# Altium project PCB_Project1.PrjPCB
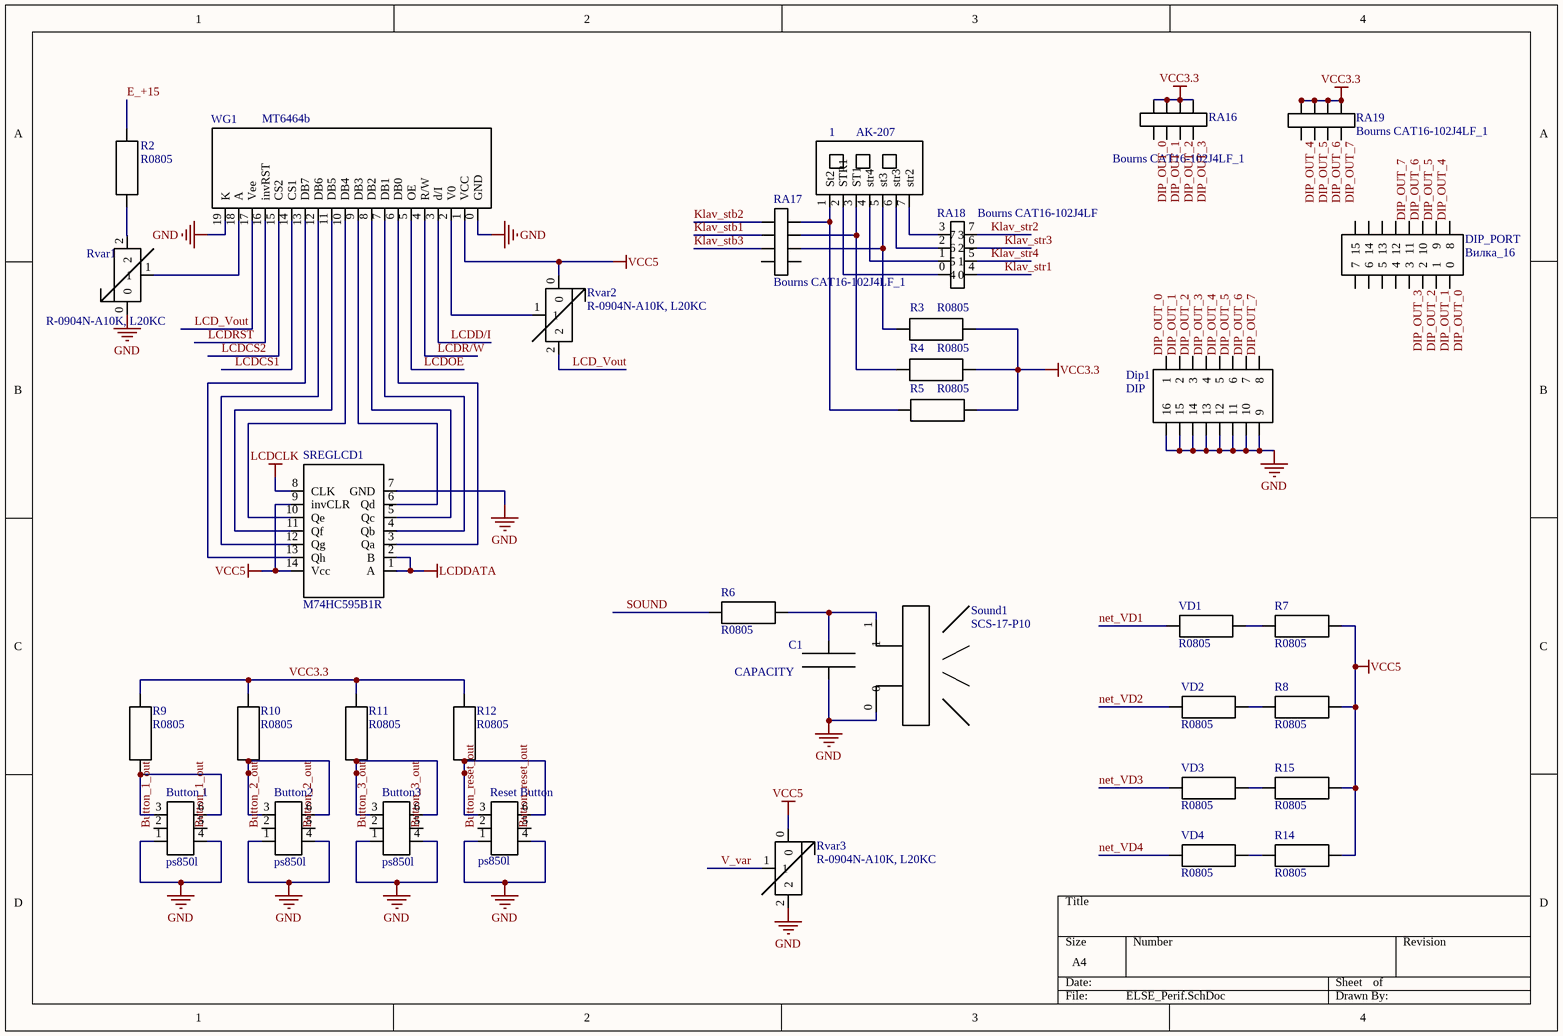
[diagram p0: ELSE_Perif.SchDoc]
6 sheets, 97 parts. Net scope: global (net labels, ports and power ports of the same name join across sheets).
Board file: ElvipPCB.PcbDoc
Sheets:
  ELSE_Perif.SchDoc
  Power Supplies.SchDoc
  Ports_2.SchDoc
  ELVIS.SchDoc
  7SEG-2.SchDoc
  MainConnector.SchDoc

## Sheet ELSE_Perif.SchDoc
size A4

### Parts
1  AK-207  [AK-207]
Button2  ps850l  [ps850l]
Button3  ps850l  [ps850l]
Button_1  ps850l  [ps850l]
C1  CAPACITY  [R0805]
Dip1  DIP  [SWD1-8]
DIP_PORT  Вилка_16  [DS1013-16]
R2  R0805  [R0805]
R3  R0805  [R0805]
R4  R0805  [R0805]
R5  R0805  [R0805]
R6  R0805  [R0805]
R7  R0805  [R0805]
R8  R0805  [R0805]
R9  R0805  [R0805]
R10  R0805  [R0805]
R11  R0805  [R0805]
R12  R0805  [R0805]
R14  R0805  [R0805]
R15  R0805  [R0805]
RA16  Bourns CAT16-102J4LF_1  [CAT16-102J4LF_2]
RA17  Bourns CAT16-102J4LF_1  [CAT16-102J4LF_2]
RA18  Bourns CAT16-102J4LF  [CAT16-102J4LF]
RA19  Bourns CAT16-102J4LF_1  [CAT16-102J4LF_2]
Reset_Button  ps850l  [ps850l]
Rvar1  R-0904N-A10K, L20KC  [R-0904N-A10K, L20KC]
Rvar2  R-0904N-A10K, L20KC  [R-0904N-A10K, L20KC]
Rvar3  R-0904N-A10K, L20KC  [R-0904N-A10K, L20KC]
Sound1  SCS-17-P10  [SCS-17-P10]
SREGLCD1  M74HC595B1R  [SN74HC164DRX]
VD1  R0805  [R0805]
VD2  R0805  [R0805]
VD3  R0805  [R0805]
VD4  R0805  [R0805]
WG1  MT6464b  [WG12864A]

### Nets
GND: Button2.1 Button2.4 Button3.1 Button3.4 Button_1.1 Button_1.4 C1.1 Dip1.9 Dip1.10 Dip1.11 Dip1.12 Dip1.13 Dip1.14 Dip1.15 Dip1.16 Reset_Button.1 Reset_Button.4 Rvar1.0 Rvar3.2 Sound1.0 SREGLCD1.7(GND) WG1.0(GND) WG1.19(K)
lCDCLK: SREGLCD1.8(CLK)
lCDDATA: SREGLCD1.1(A) SREGLCD1.2(B)
VCC3.3: R3.1 R4.1 R5.1 R9.1 R10.1 R11.1 R12.1 RA16.4 RA16.5 RA16.6 RA16.7 RA19.4 RA19.5 RA19.6 RA19.7
VCC5: R7.2 R8.2 R14.2 R15.2 Rvar2.0 Rvar3.0 SREGLCD1.9(invCLR) SREGLCD1.14(Vcc) WG1.1(VCC)
Button_1_out: Button_1.2 Button_1.5
Button_2_out: Button2.2 Button2.5
Button_3_out: Button3.2 Button3.5
Button_reset_out: Reset_Button.2 Reset_Button.5
DIP_OUT_0: Dip1.1 DIP_PORT.0 RA16.0
DIP_OUT_1: Dip1.2 DIP_PORT.1 RA16.1
DIP_OUT_2: Dip1.3 DIP_PORT.2 RA16.2
DIP_OUT_3: Dip1.4 DIP_PORT.3 RA16.3
DIP_OUT_4: Dip1.5 DIP_PORT.8 RA19.0
DIP_OUT_5: Dip1.6 DIP_PORT.9 RA19.1
DIP_OUT_6: Dip1.7 DIP_PORT.10 RA19.2
DIP_OUT_7: Dip1.8 DIP_PORT.11 RA19.3
E_+15: R2.2
Klav_stb1: RA17.2
Klav_stb2: RA17.3
Klav_stb3: RA17.1
Klav_str1: RA18.4
Klav_str2: RA18.7
Klav_str3: RA18.6
Klav_str4: RA18.5
LCD_Vout: Rvar2.2 WG1.17(Vee)
LCDCS1: WG1.14(CS1)
LCDCS2: WG1.15(CS2)
LCDD/I: WG1.3(d/I)
LCDOE: WG1.5(OE)
LCDR/W: WG1.4(R/W)
LCDRST: WG1.16(invRST)
net_VD1: VD1.1
net_VD2: VD2.1
net_VD3: VD3.1
net_VD4: VD4.1
SOUND: R6.1
V_var: Rvar3.1
Net1_1: 1.1(St2) R5.2 RA17.4
Net1_2: 1.2(STR1) RA18.0
Net1_3: 1.3(ST1) R4.2 RA17.5
Net1_4: 1.4(str4) RA18.1
Net1_5: 1.5(st3) R3.2 RA17.6
Net1_6: 1.6(str3) RA18.2
Net1_7: 1.7(str2) RA18.3
NetButton2_3: Button2.3 Button2.6 R10.2
NetButton3_3: Button3.3 Button3.6 R11.2
NetButton_1_3: Button_1.3 Button_1.6 R9.2
NetC1_2: C1.2 R6.2 Sound1.1
NetR2_1: R2.1 Rvar1.2
NetR7_1: R7.1 VD1.2
NetR8_1: R8.1 VD2.2
NetR12_2: R12.2 Reset_Button.3 Reset_Button.6
NetR14_1: R14.1 VD4.2
NetR15_1: R15.1 VD3.2
NetRvar1_1: Rvar1.1 WG1.18(A)
NetRvar2_1: Rvar2.1 WG1.2(V0)
NetSREGLCD1_3: SREGLCD1.3(Qa) WG1.6(DB0)
NetSREGLCD1_4: SREGLCD1.4(Qb) WG1.7(DB1)
NetSREGLCD1_5: SREGLCD1.5(Qc) WG1.8(DB2)
NetSREGLCD1_6: SREGLCD1.6(Qd) WG1.9(DB3)
NetSREGLCD1_10: SREGLCD1.10(Qe) WG1.10(DB4)
NetSREGLCD1_11: SREGLCD1.11(Qf) WG1.11(DB5)
NetSREGLCD1_12: SREGLCD1.12(Qg) WG1.12(DB6)
NetSREGLCD1_13: SREGLCD1.13(Qh) WG1.13(DB7)

Not connected (* = marked no-connect by the designer): DIP_PORT 4 5 6 7 12 13 14 15; RA17 0 7

### Library data of the parts
DIP_PORT = DS1013-16: 16_pin

## Sheet Power Supplies.SchDoc
size A4
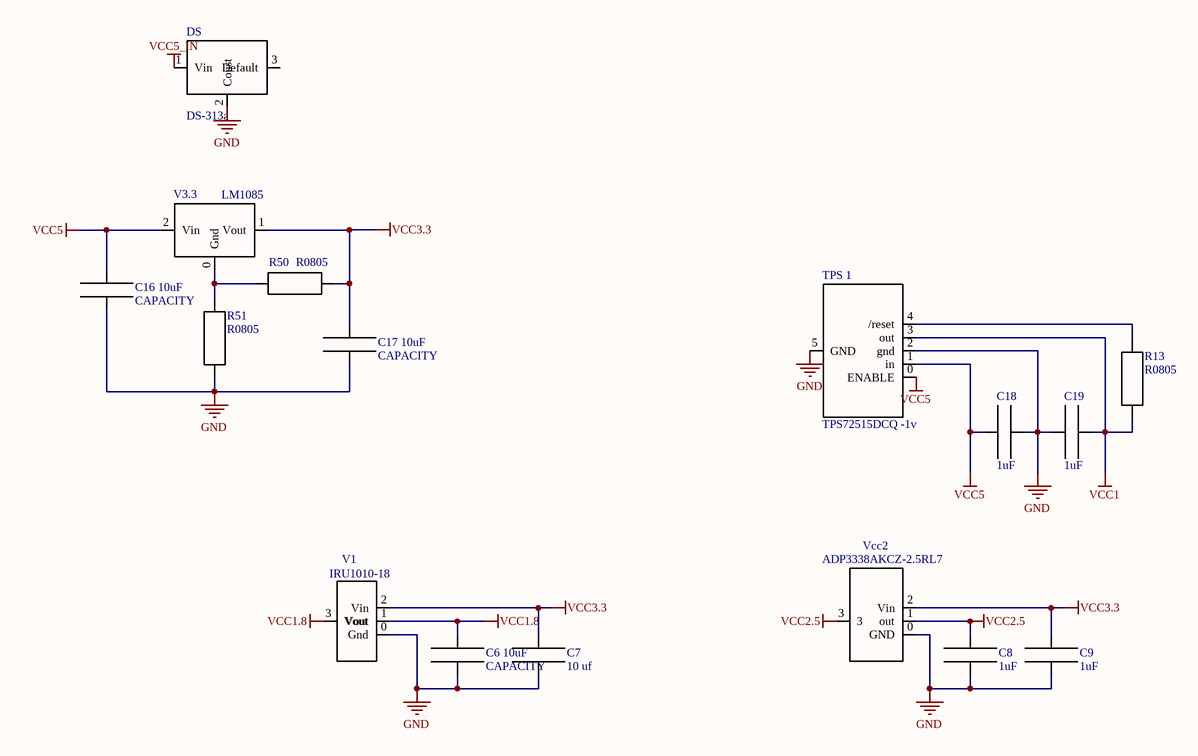
[diagram p1: Power Supplies.SchDoc]

### Parts
C6_10uF  CAPACITY  [1206]
C7  10 uf  [1206]
C8  1uF  [1206]
C9  1uF  [1206]
C16_10uF  CAPACITY  [1206]
C17_10uF  CAPACITY  [1206]
C18  1uF  [1206]
C19  1uF  [1206]
DS  DS-313a  [ds-313]
R13  R0805  [R0805]
R50  R0805  [R0805]
R51  R0805  [R0805]
TPS_1  TPS72515DCQ -1v  [SOT223-5]
V1  IRU1010-18  [IRU1010-18]
V3.3  LM1085  [LM1085]
Vcc2  ADP3338AKCZ-2.5RL7  [sot223]

### Nets
GND: C6_10uF.2 C7.2 C8.2 C9.2 C16_10uF.2 C17_10uF.2 C18.2 C19.1 DS.2(Const) R51.1 TPS_1.2(gnd) TPS_1.5(GND) V1.0(Gnd) Vcc2.0(GND)
VCC1: C19.2 R13.1 TPS_1.3(out)
VCC1.8: C6_10uF.1 V1.1(Vout) V1.3(Vout)
VCC2.5: C8.1 Vcc2.1(out) Vcc2.3
VCC3.3: C7.1 C9.1 C17_10uF.1 R50.2 V1.2(Vin) V3.3.1(Vout) Vcc2.2(Vin)
VCC5: C16_10uF.1 C18.1 TPS_1.0(ENABLE) TPS_1.1(in) V3.3.2(Vin)
VCC5_IN: DS.1(Vin)
NetR13_2: R13.2 TPS_1.4(/reset)
NetR50_1: R50.1 R51.2 V3.3.0(Gnd)

Not connected (* = marked no-connect by the designer): DS 3(Default)

### Library data of the parts
C7-C9 C18 C19 = CAPACITY

## Sheet Ports_2.SchDoc
size A4
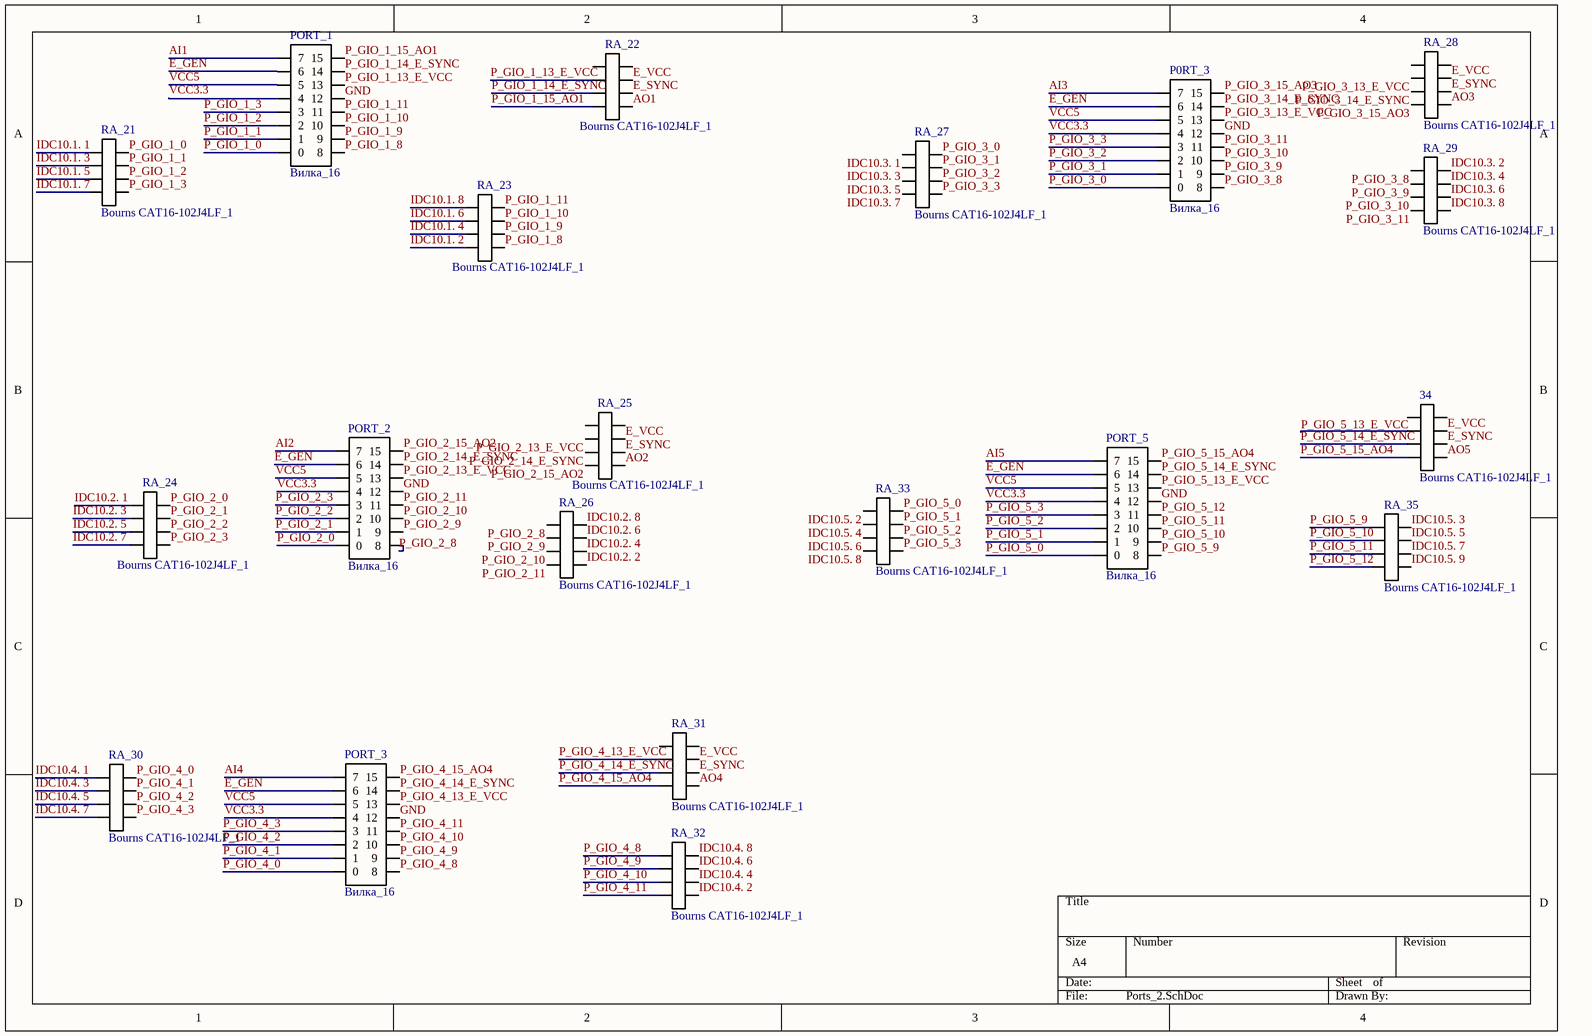
[diagram p2: Ports_2.SchDoc]

### Parts
34  Bourns CAT16-102J4LF_1  [CAT16-102J4LF_2]
P0RT_3  Вилка_16  [DS1013-16]
PORT_1  Вилка_16  [DS1013-16]
PORT_2  Вилка_16  [DS1013-16]
PORT_3  Вилка_16  [DS1013-16]
PORT_5  Вилка_16  [DS1013-16]
RA_21  Bourns CAT16-102J4LF_1  [CAT16-102J4LF_2]
RA_22  Bourns CAT16-102J4LF_1  [CAT16-102J4LF_2]
RA_23  Bourns CAT16-102J4LF_1  [CAT16-102J4LF_2]
RA_24  Bourns CAT16-102J4LF_1  [CAT16-102J4LF_2]
RA_25  Bourns CAT16-102J4LF_1  [CAT16-102J4LF_2]
RA_26  Bourns CAT16-102J4LF_1  [CAT16-102J4LF_2]
RA_27  Bourns CAT16-102J4LF_1  [CAT16-102J4LF_2]
RA_28  Bourns CAT16-102J4LF_1  [CAT16-102J4LF_2]
RA_29  Bourns CAT16-102J4LF_1  [CAT16-102J4LF_2]
RA_30  Bourns CAT16-102J4LF_1  [CAT16-102J4LF_2]
RA_31  Bourns CAT16-102J4LF_1  [CAT16-102J4LF_2]
RA_32  Bourns CAT16-102J4LF_1  [CAT16-102J4LF_2]
RA_33  Bourns CAT16-102J4LF_1  [CAT16-102J4LF_2]
RA_35  Bourns CAT16-102J4LF_1  [CAT16-102J4LF_2]

### Nets
GND: P0RT_3.12 PORT_1.12 PORT_2.12 PORT_3.12 PORT_5.12
VCC3.3: P0RT_3.4 PORT_1.4 PORT_2.4 PORT_3.4 PORT_5.4
VCC5: P0RT_3.5 PORT_1.5 PORT_2.5 PORT_3.5 PORT_5.5
AI1: PORT_1.7
AI2: PORT_2.7
AI3: P0RT_3.7
AI4: PORT_3.7
AI5: PORT_5.7
AO1: RA_22.4
AO2: RA_25.4
AO3: RA_28.0
AO4: RA_31.4
AO5: 34.0
E_GEN: P0RT_3.6 PORT_1.6 PORT_2.6 PORT_3.6 PORT_5.6
E_SYNC: 34.1 RA_22.5 RA_25.5 RA_28.1 RA_31.5
E_VCC: 34.2 RA_22.6 RA_25.6 RA_28.2 RA_31.6
IDC10.1. 1: RA_21.4
IDC10.1. 2: RA_23.3
IDC10.1. 3: RA_21.5
IDC10.1. 4: RA_23.2
IDC10.1. 5: RA_21.6
IDC10.1. 6: RA_23.1
IDC10.1. 7: RA_21.7
IDC10.1. 8: RA_23.0
IDC10.2. 1: RA_24.0
IDC10.2. 2: RA_26.0
IDC10.2. 3: RA_24.1
IDC10.2. 4: RA_26.1
IDC10.2. 5: RA_24.2
IDC10.2. 6: RA_26.2
IDC10.2. 7: RA_24.3
IDC10.2. 8: RA_26.3
IDC10.3. 1: RA_27.4
IDC10.3. 2: RA_29.3
IDC10.3. 3: RA_27.5
IDC10.3. 4: RA_29.2
IDC10.3. 5: RA_27.6
IDC10.3. 6: RA_29.1
IDC10.3. 7: RA_27.7
IDC10.3. 8: RA_29.0
IDC10.4. 1: RA_30.4
IDC10.4. 2: RA_32.0
IDC10.4. 3: RA_30.5
IDC10.4. 4: RA_32.1
IDC10.4. 5: RA_30.6
IDC10.4. 6: RA_32.2
IDC10.4. 7: RA_30.7
IDC10.4. 8: RA_32.3
IDC10.5. 2: RA_33.4
IDC10.5. 3: RA_35.3
IDC10.5. 4: RA_33.5
IDC10.5. 5: RA_35.2
IDC10.5. 6: RA_33.6
IDC10.5. 7: RA_35.1
IDC10.5. 8: RA_33.7
IDC10.5. 9: RA_35.0
P_GIO_1_0: PORT_1.0 RA_21.3
P_GIO_1_1: PORT_1.1 RA_21.2
P_GIO_1_2: PORT_1.2 RA_21.1
P_GIO_1_3: PORT_1.3 RA_21.0
P_GIO_1_8: PORT_1.8 RA_23.4
P_GIO_1_9: PORT_1.9 RA_23.5
P_GIO_1_10: PORT_1.10 RA_23.6
P_GIO_1_11: PORT_1.11 RA_23.7
P_GIO_1_13_E_VCC: PORT_1.13 RA_22.1
P_GIO_1_14_E_SYNC: PORT_1.14 RA_22.2
P_GIO_1_15_AO1: PORT_1.15 RA_22.3
P_GIO_2_0: PORT_2.0 RA_24.7
P_GIO_2_1: PORT_2.1 RA_24.6
P_GIO_2_2: PORT_2.2 RA_24.5
P_GIO_2_3: PORT_2.3 RA_24.4
P_GIO_2_8: PORT_2.8 RA_26.4
P_GIO_2_9: PORT_2.9 RA_26.5
P_GIO_2_10: PORT_2.10 RA_26.6
P_GIO_2_11: PORT_2.11 RA_26.7
P_GIO_2_13_E_VCC: PORT_2.13 RA_25.1
P_GIO_2_14_E_SYNC: PORT_2.14 RA_25.2
P_GIO_2_15_AO2: PORT_2.15 RA_25.3
P_GIO_3_0: P0RT_3.0 RA_27.3
P_GIO_3_1: P0RT_3.1 RA_27.2
P_GIO_3_2: P0RT_3.2 RA_27.1
P_GIO_3_3: P0RT_3.3 RA_27.0
P_GIO_3_8: P0RT_3.8 RA_29.4
P_GIO_3_9: P0RT_3.9 RA_29.5
P_GIO_3_10: P0RT_3.10 RA_29.6
P_GIO_3_11: P0RT_3.11 RA_29.7
P_GIO_3_13_E_VCC: P0RT_3.13 RA_28.5
P_GIO_3_14_E_SYNC: P0RT_3.14 RA_28.6
P_GIO_3_15_AO3: P0RT_3.15 RA_28.7
P_GIO_4_0: PORT_3.0 RA_30.3
P_GIO_4_1: PORT_3.1 RA_30.2
P_GIO_4_2: PORT_3.2 RA_30.1
P_GIO_4_3: PORT_3.3 RA_30.0
P_GIO_4_8: PORT_3.8 RA_32.4
P_GIO_4_9: PORT_3.9 RA_32.5
P_GIO_4_10: PORT_3.10 RA_32.6
P_GIO_4_11: PORT_3.11 RA_32.7
P_GIO_4_13_E_VCC: PORT_3.13 RA_31.1
P_GIO_4_14_E_SYNC: PORT_3.14 RA_31.2
P_GIO_4_15_AO4: PORT_3.15 RA_31.3
P_GIO_5_0: PORT_5.0 RA_33.3
P_GIO_5_1: PORT_5.1 RA_33.2
P_GIO_5_2: PORT_5.2 RA_33.1
P_GIO_5_3: PORT_5.3 RA_33.0
P_GIO_5_9: PORT_5.8 RA_35.4
P_GIO_5_10: PORT_5.9 RA_35.5
P_GIO_5_11: PORT_5.10 RA_35.6
P_GIO_5_12: PORT_5.11 RA_35.7
P_GIO_5_13_E_VCC: 34.5 PORT_5.13
P_GIO_5_14_E_SYNC: 34.6 PORT_5.14
P_GIO_5_15_AO4: 34.7 PORT_5.15

Not connected (* = marked no-connect by the designer): 34 3 4; RA_22 0 7; RA_25 0 7; RA_28 3 4; RA_31 0 7

### Library data of the parts
P0RT_3 PORT_1-PORT_3 PORT_5 = DS1013-16: 16_pin

## Sheet ELVIS.SchDoc
size A4
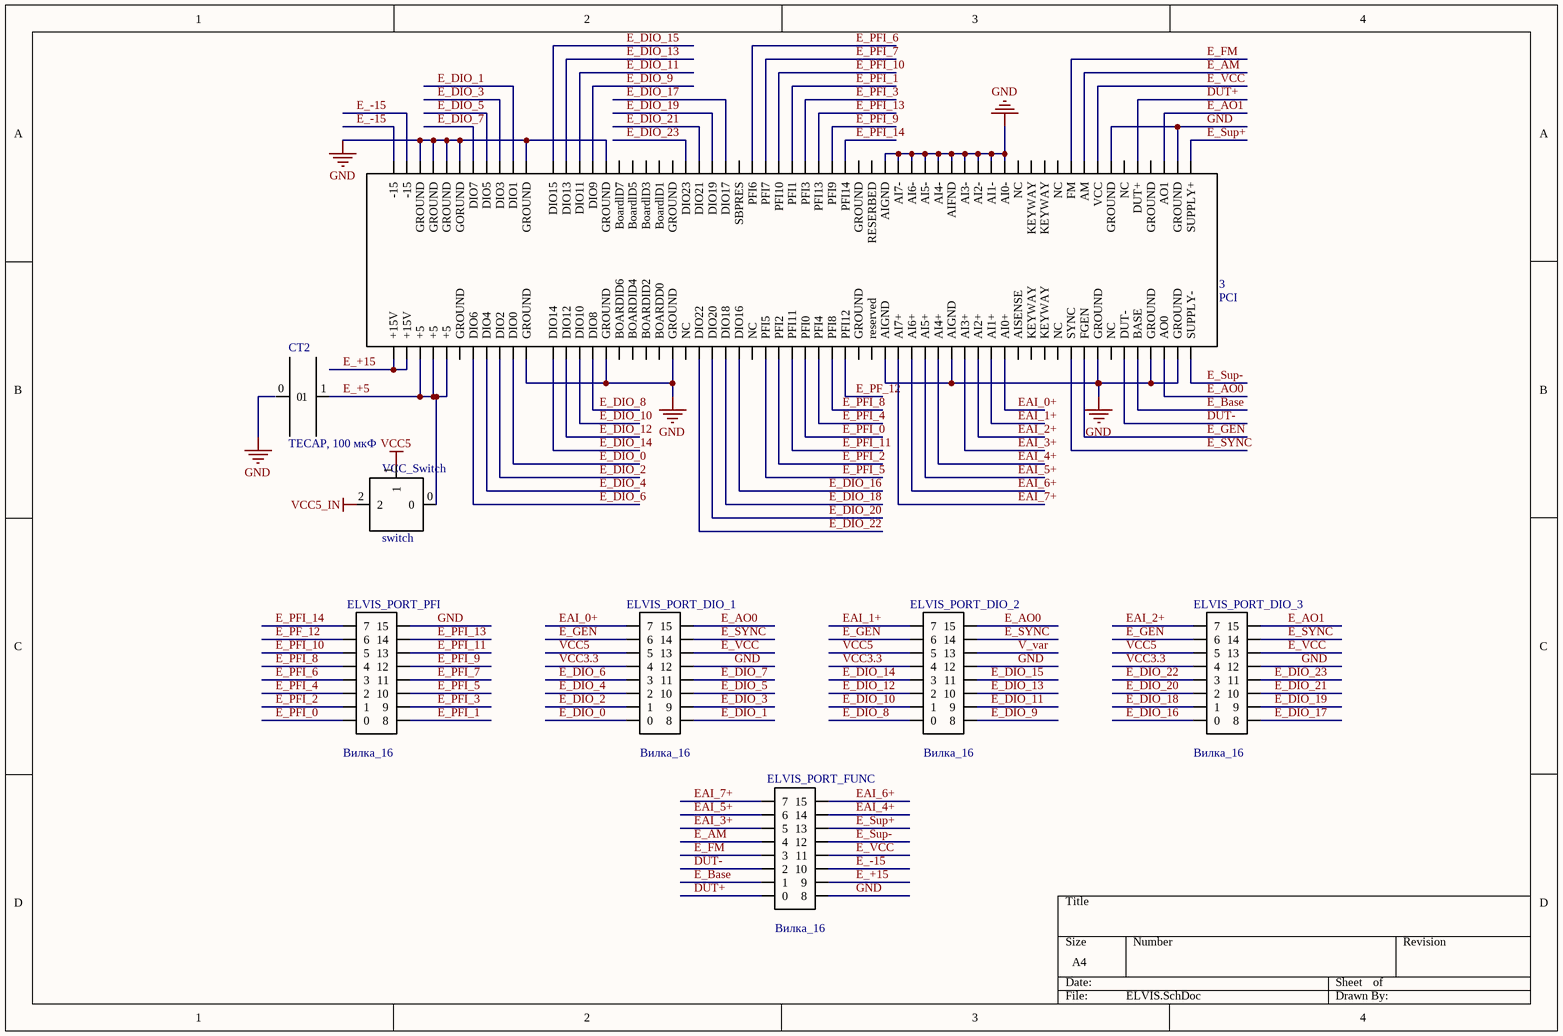
[diagram p3: ELVIS.SchDoc]

### Parts
3  PCI  [PCI-120]
CT2  TECAP, 100 мкФ  [tantal cap]
ELVIS_PORT_DIO_1  Вилка_16  [DS1013-16]
ELVIS_PORT_DIO_2  Вилка_16  [DS1013-16]
ELVIS_PORT_DIO_3  Вилка_16  [DS1013-16]
ELVIS_PORT_FUNC  Вилка_16  [DS1013-16]
ELVIS_PORT_PFI  Вилка_16  [DS1013-16]
VCC_Switch  switch  [К(Р)142ЕН5В]

### Nets
GND: 3.10(GROUND) 3.15(GROUND) 3.20(GROUND) 3.36(AIGND) 3.41(AIGND) 3.51(GROUND) 3.55(GROUND) 3.57(GROUND) 3.60(GROUND) 3.65(GROUND) 3.72(AI0-) 3.73(AI1-) 3.74(AI2-) 3.75(AI3-) 3.76(AIFND) 3.77(AI4-) 3.78(AI5-) 3.79(AI6-) 3.80(AI7-) 3.81(AIGND) 3.102(GROUND) 3.107(GROUND) 3.112(GORUND) 3.113(GROUND) 3.114(GROUND) 3.115(GROUND) ELVIS_PORT_DIO_1.12 ELVIS_PORT_DIO_2.12 ELVIS_PORT_DIO_3.12 ELVIS_PORT_FUNC.8 ELVIS_PORT_PFI.15
VCC3.3: ELVIS_PORT_DIO_1.4 ELVIS_PORT_DIO_2.4 ELVIS_PORT_DIO_3.4
VCC5: ELVIS_PORT_DIO_1.5 ELVIS_PORT_DIO_2.5 ELVIS_PORT_DIO_3.5 VCC_Switch.1
VCC5_IN: VCC_Switch.2
DUT+: 3.63(DUT+) ELVIS_PORT_FUNC.0
DUT-: 3.53(DUT-) ELVIS_PORT_FUNC.2
E_+5: 3.2(+5) 3.3(+5) 3.4(+5) CT2.1 VCC_Switch.0
E_+15: 3.0(+15V) 3.1(+15V) ELVIS_PORT_FUNC.9
E_-15: 3.116(-15) 3.117(-15) ELVIS_PORT_FUNC.10
E_AM: 3.67(AM) ELVIS_PORT_FUNC.4
E_AO0: 3.56(AO0) ELVIS_PORT_DIO_1.15 ELVIS_PORT_DIO_2.15
E_AO1: 3.61(AO1) ELVIS_PORT_DIO_3.15
E_Base: 3.54(BASE) ELVIS_PORT_FUNC.1
E_DIO_0: 3.9(DIO0) ELVIS_PORT_DIO_1.0
E_DIO_1: 3.108(DIO1) ELVIS_PORT_DIO_1.8
E_DIO_2: 3.8(DIO2) ELVIS_PORT_DIO_1.1
E_DIO_3: 3.109(DIO3) ELVIS_PORT_DIO_1.9
E_DIO_4: 3.7(DIO4) ELVIS_PORT_DIO_1.2
E_DIO_5: 3.110(DIO5) ELVIS_PORT_DIO_1.10
E_DIO_6: 3.6(DIO6) ELVIS_PORT_DIO_1.3
E_DIO_7: 3.111(DIO7) ELVIS_PORT_DIO_1.11
E_DIO_8: 3.14(DIO8) ELVIS_PORT_DIO_2.0
E_DIO_9: 3.103(DIO9) ELVIS_PORT_DIO_2.8
E_DIO_10: 3.13(DIO10) ELVIS_PORT_DIO_2.1
E_DIO_11: 3.104(DIO11) ELVIS_PORT_DIO_2.9
E_DIO_12: 3.12(DIO12) ELVIS_PORT_DIO_2.2
E_DIO_13: 3.105(DIO13) ELVIS_PORT_DIO_2.10
E_DIO_14: 3.11(DIO14) ELVIS_PORT_DIO_2.3
E_DIO_15: 3.106(DIO15) ELVIS_PORT_DIO_2.11
E_DIO_16: 3.25(DIO16) ELVIS_PORT_DIO_3.0
E_DIO_17: 3.93(DIO17) ELVIS_PORT_DIO_3.8
E_DIO_18: 3.24(DIO18) ELVIS_PORT_DIO_3.1
E_DIO_19: 3.94(DIO19) ELVIS_PORT_DIO_3.9
E_DIO_20: 3.23(DIO20) ELVIS_PORT_DIO_3.2
E_DIO_21: 3.95(DIO21) ELVIS_PORT_DIO_3.10
E_DIO_22: 3.22(DIO22) ELVIS_PORT_DIO_3.3
E_DIO_23: 3.96(DIO23) ELVIS_PORT_DIO_3.11
E_FM: 3.68(FM) ELVIS_PORT_FUNC.3
E_GEN: 3.50(FGEN) ELVIS_PORT_DIO_1.6 ELVIS_PORT_DIO_2.6 ELVIS_PORT_DIO_3.6
E_PF_12: 3.33(PFI12) ELVIS_PORT_PFI.6
E_PFI_0: 3.30(PFI0) ELVIS_PORT_PFI.0
E_PFI_1: 3.88(PFI1) ELVIS_PORT_PFI.8
E_PFI_2: 3.28(PFI2) ELVIS_PORT_PFI.1
E_PFI_3: 3.87(PFI3) ELVIS_PORT_PFI.9
E_PFI_4: 3.31(PFI4) ELVIS_PORT_PFI.2
E_PFI_5: 3.27(PFI5) ELVIS_PORT_PFI.10
E_PFI_6: 3.91(PFI6) ELVIS_PORT_PFI.3
E_PFI_7: 3.90(PFI7) ELVIS_PORT_PFI.11
E_PFI_8: 3.32(PFI8) ELVIS_PORT_PFI.4
E_PFI_9: 3.85(PFI9) ELVIS_PORT_PFI.12
E_PFI_10: 3.89(PFI10) ELVIS_PORT_PFI.5
E_PFI_11: 3.29(PFI11) ELVIS_PORT_PFI.13
E_PFI_13: 3.86(PFI13) ELVIS_PORT_PFI.14
E_PFI_14: 3.84(PFI14) ELVIS_PORT_PFI.7
E_Sup+: 3.59(SUPPLY+) ELVIS_PORT_FUNC.13
E_Sup-: 3.58(SUPPLY-) ELVIS_PORT_FUNC.12
E_SYNC: 3.49(SYNC) ELVIS_PORT_DIO_1.14 ELVIS_PORT_DIO_2.14 ELVIS_PORT_DIO_3.14
E_VCC: 3.66(VCC) ELVIS_PORT_DIO_1.13 ELVIS_PORT_DIO_3.13 ELVIS_PORT_FUNC.11
EAI_0+: 3.45(AI0+) ELVIS_PORT_DIO_1.7
EAI_1+: 3.44(AI1+) ELVIS_PORT_DIO_2.7
EAI_2+: 3.43(AI2+) ELVIS_PORT_DIO_3.7
EAI_3+: 3.42(AI3+) ELVIS_PORT_FUNC.5
EAI_4+: 3.40(AI4+) ELVIS_PORT_FUNC.14
EAI_5+: 3.39(AI5+) ELVIS_PORT_FUNC.6
EAI_6+: 3.38(AI6+) ELVIS_PORT_FUNC.15
EAI_7+: 3.37(AI7+) ELVIS_PORT_FUNC.7
V_var: ELVIS_PORT_DIO_2.13

Not connected (* = marked no-connect by the designer): 3 5(GROUND) 16(BOARDID6) 17(BOARDID4) 18(BOARDID2) 19(BOARDD0) 21(NC) 26(NC) 34(GROUND) 35(reserved) 46(AISENSE) 47(KEYWAY) 48(NC) 52(NC) 62(GROUND) 64(NC) 69(NC) 70(KEYWAY) 71(NC) 82(RESERBED) 83(GROUND) 92(SBPRES) 97(GROUND) 98(BoardlD1) 99(BoardlD3) 100(BoardlD5) 101(BoardlD7) 118(KEYWAY) 119(KEYWAY); CT2 0

### Library data of the parts
ELVIS_PORT_DIO_1-ELVIS_PORT_DIO_3 ELVIS_PORT_FUNC ELVIS_PORT_PFI = DS1013-16: 16_pin

## Sheet 7SEG-2.SchDoc
size A4
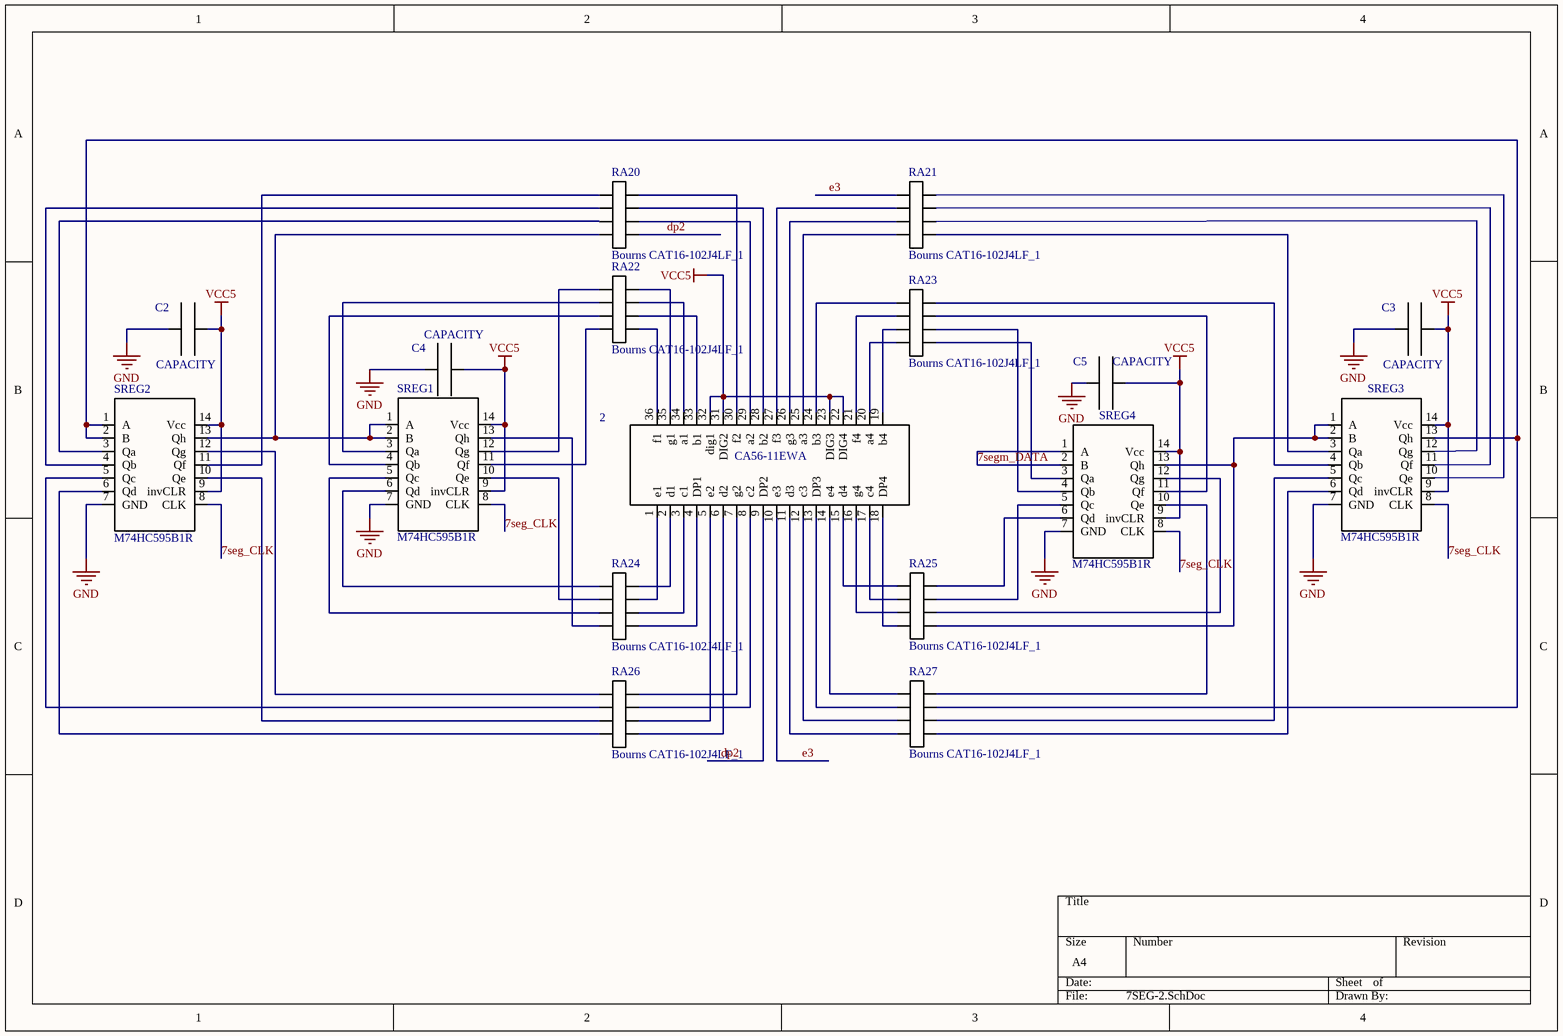
[diagram p4: 7SEG-2.SchDoc]

### Parts
2  CA56-11EWA  [CA56-11EWA]
C2  CAPACITY  [R0805]
C3  CAPACITY  [R0805]
C4  CAPACITY  [R0805]
C5  CAPACITY  [R0805]
RA20  Bourns CAT16-102J4LF_1  [CAT16-102J4LF_2]
RA21  Bourns CAT16-102J4LF_1  [CAT16-102J4LF_2]
RA22  Bourns CAT16-102J4LF_1  [CAT16-102J4LF_2]
RA23  Bourns CAT16-102J4LF_1  [CAT16-102J4LF_2]
RA24  Bourns CAT16-102J4LF_1  [CAT16-102J4LF_2]
RA25  Bourns CAT16-102J4LF_1  [CAT16-102J4LF_2]
RA26  Bourns CAT16-102J4LF_1  [CAT16-102J4LF_2]
RA27  Bourns CAT16-102J4LF_1  [CAT16-102J4LF_2]
SREG1  M74HC595B1R  [SN74HC164DRX]
SREG2  M74HC595B1R  [SN74HC164DRX]
SREG3  M74HC595B1R  [SN74HC164DRX]
SREG4  M74HC595B1R  [SN74HC164DRX]

### Nets
GND: C2.1 C3.1 C4.1 C5.1 SREG1.7(GND) SREG2.7(GND) SREG3.7(GND) SREG4.7(GND)
VCC5: 2.22(DIG4) 2.23(DIG3) 2.31(DIG2) 2.32(dig1) C2.2 C3.2 C4.2 C5.2 SREG1.9(invCLR) SREG1.14(Vcc) SREG2.9(invCLR) SREG2.14(Vcc) SREG3.9(invCLR) SREG3.14(Vcc) SREG4.9(invCLR) SREG4.14(Vcc)
7seg_CLK: SREG1.8(CLK) SREG2.8(CLK) SREG3.8(CLK) SREG4.8(CLK)
7segm_DATA: SREG4.1(A) SREG4.2(B)
dp2: 2.9(DP2) RA20.3
e3: 2.10(e3) RA21.3
Net2_1: 2.1(e1) RA24.6
Net2_2: 2.2(d1) RA24.7
Net2_3: 2.3(c1) RA24.5
Net2_4: 2.4(DP1) RA24.4
Net2_5: 2.5(e2) RA26.6
Net2_6: 2.6(d2) RA26.7
Net2_7: 2.7(g2) RA26.4
Net2_8: 2.8(c2) RA26.5
Net2_11: 2.11(d3) RA27.4
Net2_12: 2.12(c3) RA27.5
Net2_13: 2.13(DP3) RA27.6
Net2_14: 2.14(e4) RA27.7
Net2_15: 2.15(d4) RA25.4
Net2_16: 2.16(g4) RA25.6
Net2_17: 2.17(c4) RA25.5
Net2_18: 2.18(DP4) RA25.7
Net2_19: 2.19(b4) RA23.1
Net2_20: 2.20(a4) RA23.0
Net2_21: 2.21(f4) RA23.2
Net2_24: 2.24(b3) RA23.3
Net2_25: 2.25(a3) RA21.0
Net2_26: 2.26(g3) RA21.1
Net2_27: 2.27(f3) RA21.2
Net2_28: 2.28(b2) RA20.1
Net2_29: 2.29(a2) RA20.2
Net2_30: 2.30(f2) RA20.0
Net2_33: 2.33(b1) RA22.1
Net2_34: 2.34(a1) RA22.2
Net2_35: 2.35(g1) RA22.3
Net2_36: 2.36(f1) RA22.0
NetRA20_4: RA20.4 SREG1.1(A) SREG1.2(B) SREG2.13(Qh)
NetRA20_5: RA20.5 SREG2.3(Qa)
NetRA20_6: RA20.6 SREG2.4(Qb)
NetRA20_7: RA20.7 SREG2.11(Qf)
NetRA21_4: RA21.4 SREG3.10(Qe)
NetRA21_5: RA21.5 SREG3.11(Qf)
NetRA21_6: RA21.6 SREG3.12(Qg)
NetRA21_7: RA21.7 SREG3.3(Qa)
NetRA22_4: RA22.4 SREG1.12(Qg)
NetRA22_5: RA22.5 SREG1.3(Qa)
NetRA22_6: RA22.6 SREG1.4(Qb)
NetRA22_7: RA22.7 SREG1.11(Qf)
NetRA23_4: RA23.4 SREG3.4(Qb)
NetRA23_5: RA23.5 SREG4.11(Qf)
NetRA23_6: RA23.6 SREG4.4(Qb)
NetRA23_7: RA23.7 SREG4.3(Qa)
NetRA24_0: RA24.0 SREG1.6(Qd)
NetRA24_1: RA24.1 SREG1.10(Qe)
NetRA24_2: RA24.2 SREG1.5(Qc)
NetRA24_3: RA24.3 SREG1.13(Qh)
NetRA25_0: RA25.0 SREG3.1(A) SREG3.2(B) SREG4.13(Qh)
NetRA25_1: RA25.1 SREG4.12(Qg)
NetRA25_2: RA25.2 SREG4.5(Qc)
NetRA25_3: RA25.3 SREG4.6(Qd)
NetRA26_0: RA26.0 SREG2.6(Qd)
NetRA26_1: RA26.1 SREG2.10(Qe)
NetRA26_2: RA26.2 SREG2.5(Qc)
NetRA26_3: RA26.3 SREG2.12(Qg)
NetRA27_0: RA27.0 SREG4.10(Qe)
NetRA27_1: RA27.1 SREG2.1(A) SREG2.2(B) SREG3.13(Qh)
NetRA27_2: RA27.2 SREG3.5(Qc)
NetRA27_3: RA27.3 SREG3.6(Qd)

## Sheet MainConnector.SchDoc
size A4
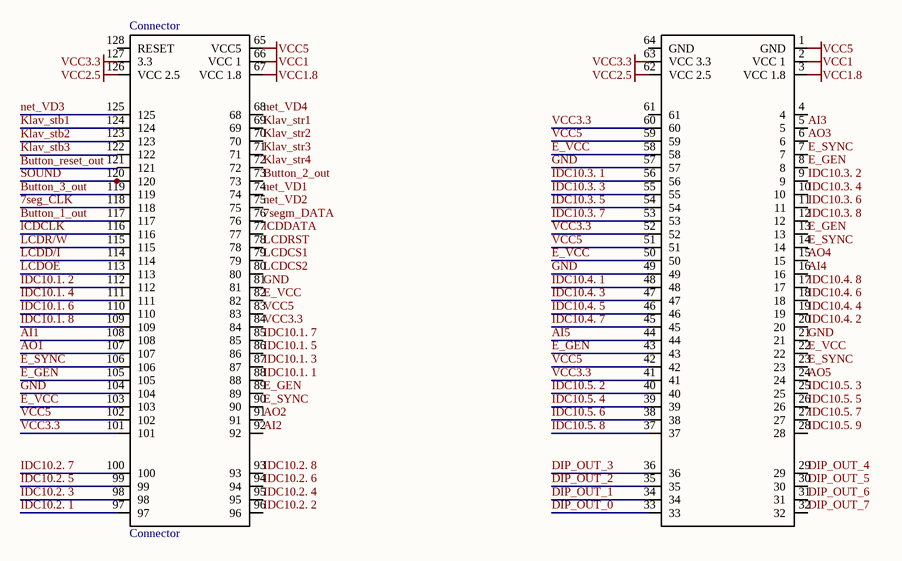
[diagram p5: MainConnector.SchDoc]

### Parts
Connector  Connector  [Connect]

### Nets
GND: Connector.21 Connector.49 Connector.57 Connector.81 Connector.104
lCDCLK: Connector.116
lCDDATA: Connector.77
VCC1: Connector.2(VCC_1) Connector.66(VCC_1)
VCC1.8: Connector.3(VCC_1.8) Connector.67(VCC_1.8)
VCC2.5: Connector.62(VCC_2.5) Connector.126(VCC_2.5)
VCC3.3: Connector.41 Connector.52 Connector.60 Connector.63(VCC_3.3) Connector.84 Connector.101 Connector.127(3.3)
VCC5: Connector.1(GND) Connector.42 Connector.51 Connector.59 Connector.65(VCC5) Connector.83 Connector.102
7seg_CLK: Connector.118
7segm_DATA: Connector.76
AI1: Connector.108
AI2: Connector.92
AI3: Connector.5
AI4: Connector.16
AI5: Connector.44
AO1: Connector.107
AO2: Connector.91
AO3: Connector.6
AO4: Connector.15
AO5: Connector.24
Button_1_out: Connector.117
Button_2_out: Connector.73
Button_3_out: Connector.119
Button_reset_out: Connector.121
DIP_OUT_0: Connector.33
DIP_OUT_1: Connector.34
DIP_OUT_2: Connector.35
DIP_OUT_3: Connector.36
DIP_OUT_4: Connector.29
DIP_OUT_5: Connector.30
DIP_OUT_6: Connector.31
DIP_OUT_7: Connector.32
E_GEN: Connector.8 Connector.13 Connector.43 Connector.89 Connector.105
E_SYNC: Connector.7 Connector.14 Connector.23 Connector.90 Connector.106
E_VCC: Connector.22 Connector.50 Connector.58 Connector.82 Connector.103
IDC10.1. 1: Connector.88
IDC10.1. 2: Connector.112
IDC10.1. 3: Connector.87
IDC10.1. 4: Connector.111
IDC10.1. 5: Connector.86
IDC10.1. 6: Connector.110
IDC10.1. 7: Connector.85
IDC10.1. 8: Connector.109
IDC10.2. 1: Connector.97
IDC10.2. 2: Connector.96
IDC10.2. 3: Connector.98
IDC10.2. 4: Connector.95
IDC10.2. 5: Connector.99
IDC10.2. 6: Connector.94
IDC10.2. 7: Connector.100
IDC10.2. 8: Connector.93
IDC10.3. 1: Connector.56
IDC10.3. 2: Connector.9
IDC10.3. 3: Connector.55
IDC10.3. 4: Connector.10
IDC10.3. 5: Connector.54
IDC10.3. 6: Connector.11
IDC10.3. 7: Connector.53
IDC10.3. 8: Connector.12
IDC10.4. 1: Connector.48
IDC10.4. 2: Connector.20
IDC10.4. 3: Connector.47
IDC10.4. 4: Connector.19
IDC10.4. 5: Connector.46
IDC10.4. 6: Connector.18
IDC10.4. 7: Connector.45
IDC10.4. 8: Connector.17
IDC10.5. 2: Connector.40
IDC10.5. 3: Connector.25
IDC10.5. 4: Connector.39
IDC10.5. 5: Connector.26
IDC10.5. 6: Connector.38
IDC10.5. 7: Connector.27
IDC10.5. 8: Connector.37
IDC10.5. 9: Connector.28
Klav_stb1: Connector.124
Klav_stb2: Connector.123
Klav_stb3: Connector.122
Klav_str1: Connector.69
Klav_str2: Connector.70
Klav_str3: Connector.71
Klav_str4: Connector.72
LCDCS1: Connector.79
LCDCS2: Connector.80
LCDD/I: Connector.114
LCDOE: Connector.113
LCDR/W: Connector.115
LCDRST: Connector.78
net_VD1: Connector.74
net_VD2: Connector.75
net_VD3: Connector.125
net_VD4: Connector.68
SOUND: Connector.120

Not connected (* = marked no-connect by the designer): Connector 4 61 64(GND) 128(RESET)

## Nets that join several sheets
GND: ELSE_Perif (23 pins), Power Supplies (14 pins), Ports_2 (5 pins), ELVIS (31 pins), 7SEG-2 (8 pins), MainConnector (5 pins)
lCDCLK: ELSE_Perif (SREGLCD1.8), MainConnector (Connector.116)
lCDDATA: ELSE_Perif (SREGLCD1.1 SREGLCD1.2), MainConnector (Connector.77)
VCC1: Power Supplies (C19.2 R13.1 TPS_1.3), MainConnector (Connector.2 Connector.66)
VCC1.8: Power Supplies (C6_10uF.1 V1.1 V1.3), MainConnector (Connector.3 Connector.67)
VCC2.5: Power Supplies (C8.1 Vcc2.1 Vcc2.3), MainConnector (Connector.62 Connector.126)
VCC3.3: ELSE_Perif (15 pins), Power Supplies (7 pins), Ports_2 (5 pins), ELVIS (ELVIS_PORT_DIO_1.4 ELVIS_PORT_DIO_2.4 ELVIS_PORT_DIO_3.4), MainConnector (7 pins)
VCC5: ELSE_Perif (9 pins), Power Supplies (5 pins), Ports_2 (5 pins), ELVIS (ELVIS_PORT_DIO_1.5 ELVIS_PORT_DIO_2.5 ELVIS_PORT_DIO_3.5 VCC_Switch.1), 7SEG-2 (16 pins), MainConnector (7 pins)
VCC5_IN: Power Supplies (DS.1), ELVIS (VCC_Switch.2)
7seg_CLK: 7SEG-2 (SREG1.8 SREG2.8 SREG3.8 SREG4.8), MainConnector (Connector.118)
7segm_DATA: 7SEG-2 (SREG4.1 SREG4.2), MainConnector (Connector.76)
AI1: Ports_2 (PORT_1.7), MainConnector (Connector.108)
AI2: Ports_2 (PORT_2.7), MainConnector (Connector.92)
AI3: Ports_2 (P0RT_3.7), MainConnector (Connector.5)
AI4: Ports_2 (PORT_3.7), MainConnector (Connector.16)
AI5: Ports_2 (PORT_5.7), MainConnector (Connector.44)
AO1: Ports_2 (RA_22.4), MainConnector (Connector.107)
AO2: Ports_2 (RA_25.4), MainConnector (Connector.91)
AO3: Ports_2 (RA_28.0), MainConnector (Connector.6)
AO4: Ports_2 (RA_31.4), MainConnector (Connector.15)
AO5: Ports_2 (34.0), MainConnector (Connector.24)
Button_1_out: ELSE_Perif (Button_1.2 Button_1.5), MainConnector (Connector.117)
Button_2_out: ELSE_Perif (Button2.2 Button2.5), MainConnector (Connector.73)
Button_3_out: ELSE_Perif (Button3.2 Button3.5), MainConnector (Connector.119)
Button_reset_out: ELSE_Perif (Reset_Button.2 Reset_Button.5), MainConnector (Connector.121)
DIP_OUT_0: ELSE_Perif (Dip1.1 DIP_PORT.0 RA16.0), MainConnector (Connector.33)
DIP_OUT_1: ELSE_Perif (Dip1.2 DIP_PORT.1 RA16.1), MainConnector (Connector.34)
DIP_OUT_2: ELSE_Perif (Dip1.3 DIP_PORT.2 RA16.2), MainConnector (Connector.35)
DIP_OUT_3: ELSE_Perif (Dip1.4 DIP_PORT.3 RA16.3), MainConnector (Connector.36)
DIP_OUT_4: ELSE_Perif (Dip1.5 DIP_PORT.8 RA19.0), MainConnector (Connector.29)
DIP_OUT_5: ELSE_Perif (Dip1.6 DIP_PORT.9 RA19.1), MainConnector (Connector.30)
DIP_OUT_6: ELSE_Perif (Dip1.7 DIP_PORT.10 RA19.2), MainConnector (Connector.31)
DIP_OUT_7: ELSE_Perif (Dip1.8 DIP_PORT.11 RA19.3), MainConnector (Connector.32)
E_+15: ELSE_Perif (R2.2), ELVIS (3.0 3.1 ELVIS_PORT_FUNC.9)
E_GEN: Ports_2 (5 pins), ELVIS (3.50 ELVIS_PORT_DIO_1.6 ELVIS_PORT_DIO_2.6 ELVIS_PORT_DIO_3.6), MainConnector (5 pins)
E_SYNC: Ports_2 (5 pins), ELVIS (3.49 ELVIS_PORT_DIO_1.14 ELVIS_PORT_DIO_2.14 ELVIS_PORT_DIO_3.14), MainConnector (5 pins)
E_VCC: Ports_2 (5 pins), ELVIS (3.66 ELVIS_PORT_DIO_1.13 ELVIS_PORT_DIO_3.13 ELVIS_PORT_FUNC.11), MainConnector (5 pins)
IDC10.1. 1: Ports_2 (RA_21.4), MainConnector (Connector.88)
IDC10.1. 2: Ports_2 (RA_23.3), MainConnector (Connector.112)
IDC10.1. 3: Ports_2 (RA_21.5), MainConnector (Connector.87)
IDC10.1. 4: Ports_2 (RA_23.2), MainConnector (Connector.111)
IDC10.1. 5: Ports_2 (RA_21.6), MainConnector (Connector.86)
IDC10.1. 6: Ports_2 (RA_23.1), MainConnector (Connector.110)
IDC10.1. 7: Ports_2 (RA_21.7), MainConnector (Connector.85)
IDC10.1. 8: Ports_2 (RA_23.0), MainConnector (Connector.109)
IDC10.2. 1: Ports_2 (RA_24.0), MainConnector (Connector.97)
IDC10.2. 2: Ports_2 (RA_26.0), MainConnector (Connector.96)
IDC10.2. 3: Ports_2 (RA_24.1), MainConnector (Connector.98)
IDC10.2. 4: Ports_2 (RA_26.1), MainConnector (Connector.95)
IDC10.2. 5: Ports_2 (RA_24.2), MainConnector (Connector.99)
IDC10.2. 6: Ports_2 (RA_26.2), MainConnector (Connector.94)
IDC10.2. 7: Ports_2 (RA_24.3), MainConnector (Connector.100)
IDC10.2. 8: Ports_2 (RA_26.3), MainConnector (Connector.93)
IDC10.3. 1: Ports_2 (RA_27.4), MainConnector (Connector.56)
IDC10.3. 2: Ports_2 (RA_29.3), MainConnector (Connector.9)
IDC10.3. 3: Ports_2 (RA_27.5), MainConnector (Connector.55)
IDC10.3. 4: Ports_2 (RA_29.2), MainConnector (Connector.10)
IDC10.3. 5: Ports_2 (RA_27.6), MainConnector (Connector.54)
IDC10.3. 6: Ports_2 (RA_29.1), MainConnector (Connector.11)
IDC10.3. 7: Ports_2 (RA_27.7), MainConnector (Connector.53)
IDC10.3. 8: Ports_2 (RA_29.0), MainConnector (Connector.12)
IDC10.4. 1: Ports_2 (RA_30.4), MainConnector (Connector.48)
IDC10.4. 2: Ports_2 (RA_32.0), MainConnector (Connector.20)
IDC10.4. 3: Ports_2 (RA_30.5), MainConnector (Connector.47)
IDC10.4. 4: Ports_2 (RA_32.1), MainConnector (Connector.19)
IDC10.4. 5: Ports_2 (RA_30.6), MainConnector (Connector.46)
IDC10.4. 6: Ports_2 (RA_32.2), MainConnector (Connector.18)
IDC10.4. 7: Ports_2 (RA_30.7), MainConnector (Connector.45)
IDC10.4. 8: Ports_2 (RA_32.3), MainConnector (Connector.17)
IDC10.5. 2: Ports_2 (RA_33.4), MainConnector (Connector.40)
IDC10.5. 3: Ports_2 (RA_35.3), MainConnector (Connector.25)
IDC10.5. 4: Ports_2 (RA_33.5), MainConnector (Connector.39)
IDC10.5. 5: Ports_2 (RA_35.2), MainConnector (Connector.26)
IDC10.5. 6: Ports_2 (RA_33.6), MainConnector (Connector.38)
IDC10.5. 7: Ports_2 (RA_35.1), MainConnector (Connector.27)
IDC10.5. 8: Ports_2 (RA_33.7), MainConnector (Connector.37)
IDC10.5. 9: Ports_2 (RA_35.0), MainConnector (Connector.28)
Klav_stb1: ELSE_Perif (RA17.2), MainConnector (Connector.124)
Klav_stb2: ELSE_Perif (RA17.3), MainConnector (Connector.123)
Klav_stb3: ELSE_Perif (RA17.1), MainConnector (Connector.122)
Klav_str1: ELSE_Perif (RA18.4), MainConnector (Connector.69)
Klav_str2: ELSE_Perif (RA18.7), MainConnector (Connector.70)
Klav_str3: ELSE_Perif (RA18.6), MainConnector (Connector.71)
Klav_str4: ELSE_Perif (RA18.5), MainConnector (Connector.72)
LCDCS1: ELSE_Perif (WG1.14), MainConnector (Connector.79)
LCDCS2: ELSE_Perif (WG1.15), MainConnector (Connector.80)
LCDD/I: ELSE_Perif (WG1.3), MainConnector (Connector.114)
LCDOE: ELSE_Perif (WG1.5), MainConnector (Connector.113)
LCDR/W: ELSE_Perif (WG1.4), MainConnector (Connector.115)
LCDRST: ELSE_Perif (WG1.16), MainConnector (Connector.78)
net_VD1: ELSE_Perif (VD1.1), MainConnector (Connector.74)
net_VD2: ELSE_Perif (VD2.1), MainConnector (Connector.75)
net_VD3: ELSE_Perif (VD3.1), MainConnector (Connector.125)
net_VD4: ELSE_Perif (VD4.1), MainConnector (Connector.68)
SOUND: ELSE_Perif (R6.1), MainConnector (Connector.120)
V_var: ELSE_Perif (Rvar3.1), ELVIS (ELVIS_PORT_DIO_2.13)